# Altium project Precharge.PrjPcb
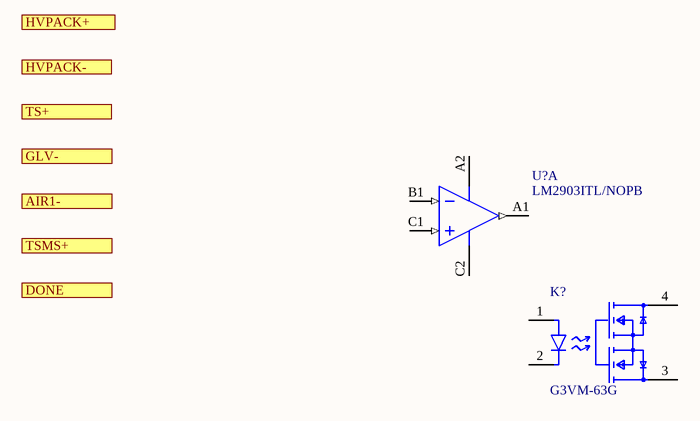
[diagram p0: precharge_schem.SchDoc]
1 sheet, 2 parts. Net scope: flat (ports and power ports of the same name join across sheets).

## Sheet precharge_schem.SchDoc
size A; SheetNumber: 1; SheetTotal: 1

### Parts
K?  G3VM-63G  [FP-G3VM-63G-MFG]
U?  LM2903ITL/NOPB  [YZR0008ADAD]  (part A of 2)

### Ports
AIR1-, DONE, GLV-, HVPACK+, HVPACK-, TS+, TSMS+

### Nets

Not connected (* = marked no-connect by the designer): K? 1(A) 2(C) 3(1_DRAIN) 4(2_DRAIN); U? A1(OUTA) A2(V+) B1(INA-) C1(INA+) C2(GND)

### Library data of the parts
K? = CMP-08825-000103-1: SSR RELAY SPST-NC 500MA 0-60V; Isolation Voltage: 1.5kV; On-State Resistance: 2.5R; Throw Configuration: SPST; Package Quantity: 400; Packaging: Rail/Tube; Mount: Surface Mount; Number of Pins: 4; Termination: Gull Wing; Relay Type: Relay; Case/Package: SOP; Load Current: 500mA; RoHS Compliant: Yes
U? = CMP-0055-00269-3: Low Power Low Offset Voltage Dual Comparator, 8-pin Micro SMD, Pb-Free; Manufacturer: Texas Instruments; CompType: Amplifiers; PackageTopMarking: XVC*I 03; High-Reliability: Y; PowerWise: N; PackageDescription: Thin Micro SMD, 8 Bump (Large), 0.5mm Pitch; PartNumber: LM2903ITL/NOPB; PinCount: 8; ComponentLink1Description: Datasheet URL; RoHS: Y; Package Reference: YZR0008ADAD; ComponentLink1URL: http://www.ti.com/general/docs/lit/getliterature.tsp?genericPartNumber=LM2903-N&fileType=pdf